# Altium schematic sheet power.SchDoc
size A3
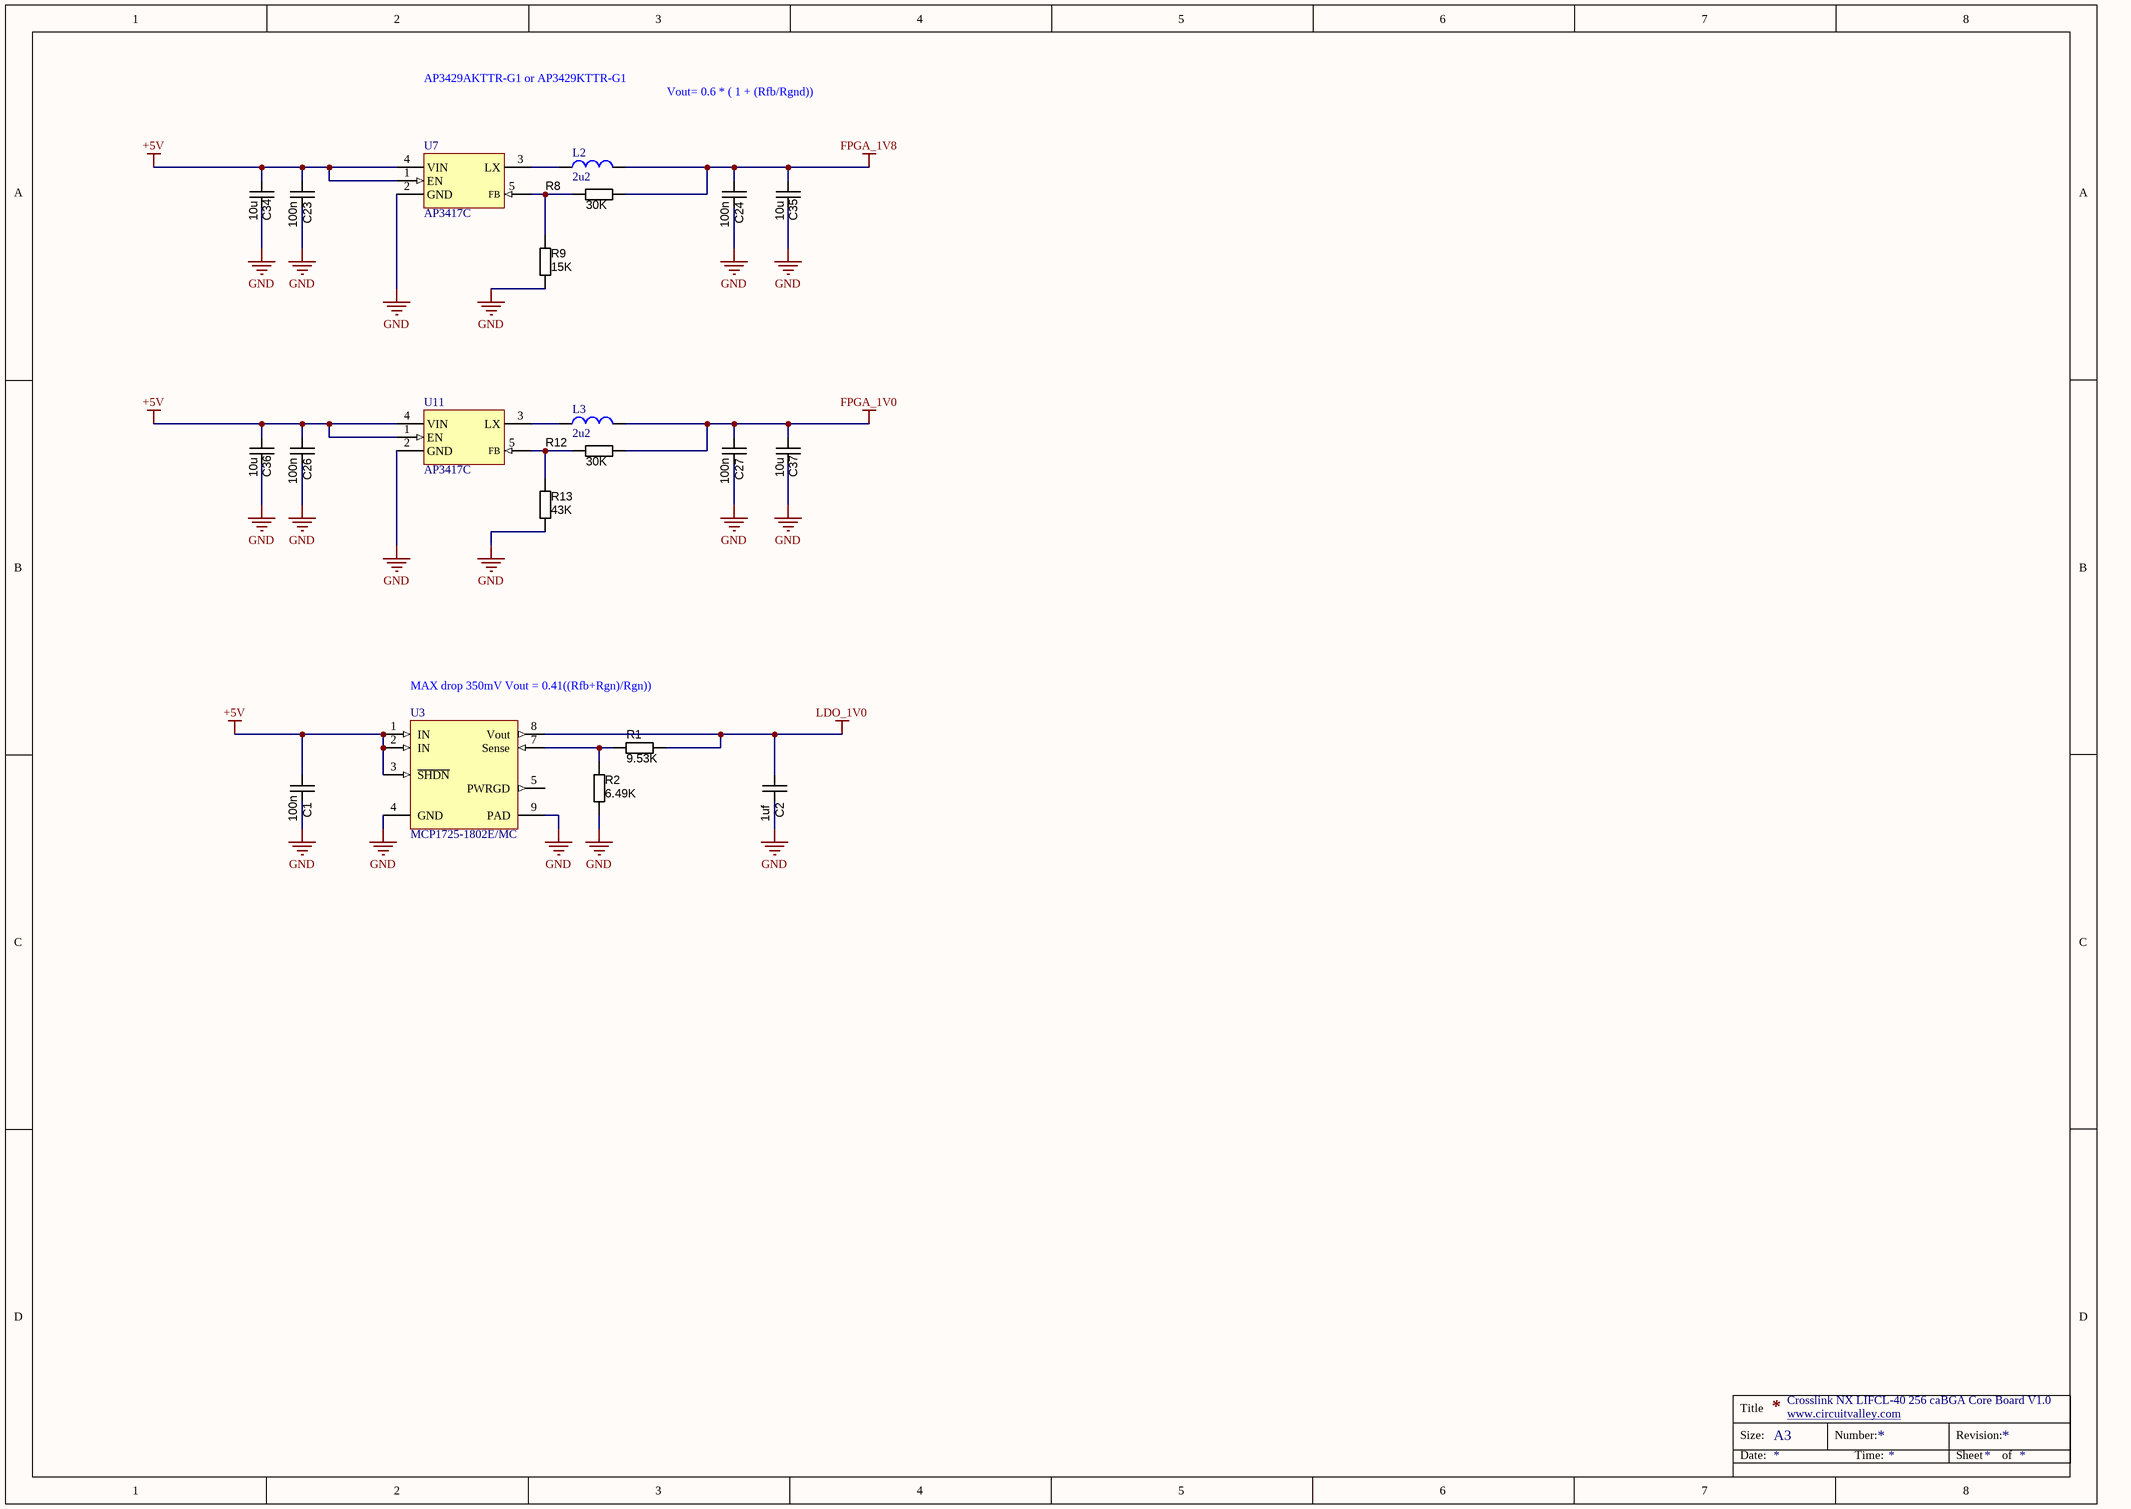
[diagram p0: power.SchDoc]

## Parts
C1  100n  [CAPC1005N]
C2  1uf  [CAPC1005N]
C23  100n  [CAPC1005N]
C24  100n  [CAPC1005N]
C26  100n  [CAPC1005N]
C27  100n  [CAPC1005N]
C34  value 10u  [CAPC1608N]  (hidden comment: approved sub OK)
C35  value 10u  [CAPC1608N]  (hidden comment: approved sub OK)
C36  value 10u  [CAPC1608N]  (hidden comment: approved sub OK)
C37  value 10u  [CAPC1608N]  (hidden comment: approved sub OK)
L2  2u2  [FDSD0420-H-2R2M]
L3  2u2  [FDSD0420-H-2R2M]
R1  value 9.53K  [RESC1005N]  (hidden comment: Thick Film)
R2  value 6.49K  [RESC1005N]  (hidden comment: Thick Film)
R8  value 30K  [RESC1005N]  (hidden comment: Thick Film)
R9  value 15K  [RESC1005N]  (hidden comment: Thick Film)
R12  value 30K  [RESC1005N]  (hidden comment: Thick Film)
R13  value 43K  [RESC1005N]  (hidden comment: Thick Film)
U3  MCP1725-1802E/MC  [DFN8_3x2]
U7  AP3417C  [SOT23-5]
U11  AP3417C  [SOT23-5]

## Nets
+5V: C1.2 C23.2 C26.2 C34.1 C36.1 U3.1(IN) U3.2(IN) U3.3(~{SHDN}) U7.1(EN) U7.4(VIN) U11.1(EN) U11.4(VIN)
FPGA_1V0: C27.2 C37.1 L3.2 R12.2
FPGA_1V8: C24.2 C35.1 L2.2 R8.2
GND: C1.1 C2.1 C23.1 C24.1 C26.1 C27.1 C34.2 C35.2 C36.2 C37.2 R2.1 R9.2 R13.1 U3.4(GND) U3.9(PAD) U7.2(GND) U11.2(GND)
LDO_1V0: C2.2 R1.2 U3.8(Vout)
NetL2_1: L2.1 U7.3(LX)
NetL3_1: L3.1 U11.3(LX)
NetR1_1: R1.1 R2.2 U3.7(Sense)
NetR8_1: R8.1 R9.1 U7.5(FB)
NetR12_1: R12.1 R13.2 U11.5(FB)

Not connected (* = marked no-connect by the designer): U3 5(PWRGD)

## Notes on the sheet
- AP3429AKTTR-G1 or AP3429KTTR-G1
- Vout= 0.6 * ( 1 + (Rfb/Rgnd))
- MAX drop 350mV Vout = 0.41((Rfb+Rgn)/Rgn))
- Crosslink NX LIFCL-40 256 caBGA Core Board V1.0
- www.circuitvalley.com <http://www.circuitvalley.com>
- Title
- Size:
- Date:
- A3
- Number:
- Time:
- Revision:
- Sheet
- of

## Library data of the parts
C1 C2 C23 C24 C26 C27 = CAPC_10n_0402_16V_10%: Capacitor SMD Cer 10nF 10% 16V X7R 0402; Manufacturer 1: AVX Corporation; Manufacturer Part Number 1: 0402YC103KAT2A; Ratings: 16V; X7R; Tolerance: ±10%; Operating Temperature: -55°C ~ 125°C; Package / Case: 0402 (1005 Metric); Size / Dimension: 0.039" L x 0.020" W (1.00mm x 0.50mm); Manufacturer 2: Yageo; Manufacturer Part Number 2: CC0402KRX7R7BB103; Supplier 1: Digi-Key; Supplier Part Number 1: 478-1114-1-ND; ComponentLink1URL: http://www.avx.com/docs/Catalogs/cx7r.pdf; ComponentLink1Description: http://www.avx.com/docs/Catalogs/cx7r.pdf; Supplier 2: Digi-Key; Supplier Part Number 2: 311-1042-1-ND; ComponentLink2URL: http://www.yageo.com/documents/recent/UPY-GPHC_X7R_6.3V-to-50V_8.pdf; ComponentLink2Description: http://www.yageo.com/documents/recent/UPY-GPHC_X7R_6.3V-to-50V_8.pdf
  C1 C23 C24 C26 C27: Value: 100n
  C2: Value: 1uf
C34-C37 = CAPC_560p_0603_5%: Capacitor SMD Cer 560pF 5% 50V NP0 0603; Manufacturer 1: AVX Corporation; Manufacturer Part Number 1: 06035A561JAT2A; Ratings: 50V; NP0; Material: ceramic; Capacitance: 470pF; Package / Case: 0603 (1608 metric); Voltage - Rated: 50V; Mounting Type: Surface Mount, MLCC; Operating Temperature: -55°C ~ 125°C; Applications: General Purpose; Size / Dimension: 0.063" L x 0.032" W (1.60mm x 0.81mm); Height - Seated (Max): -; Thickness (Max): 0.035" (0.90mm); Lead Spacing: -; Lead Style: -; ComponentLink1URL: http://www.avx.com/docs/Catalogs/ccog.pdf; ComponentLink1Description: http://www.avx.com/docs/Catalogs/ccog.pdf; Supplier 1: Digi-Key; Supplier Part Number 1: 478-1184-1-ND
L2 L3 = inductor_smd
R1 R2 R8 R9 R12 R13 = RES_3K3_0402_5%: Resistor SMD chip 3.3k Ohm 0.063W 5% 0402; Manufacturer 1: Yageo; Manufacturer Part Number 1: RC0402JR-073K3L; Ratings: 1/16 W; Package / Case: 0402 (1005 metric); Tolerance: ±5%; Material: Thick Film; Supplier 1: Digi-Key; Supplier Part Number 1: 311-3.3KJRCT-ND; ComponentLink1URL: http://www.yageo.com/documents/recent/PYu-RC0402_51_RoHS_L_6.pdf; ComponentLink1Description: http://www.yageo.com/documents/recent/PYu-RC0402_51_RoHS_L_6.pdf
U3 = MCP1725: LDO